# EasyEDA schematic Sheet_1.json
TITLE: ARDUINO PC JOYSTICK; REV: 1.0; Date: 2025-05-24; Sheet: 1/4; Drawn By: ILIAS ILIOPOULOS; Company: fryktoria.com
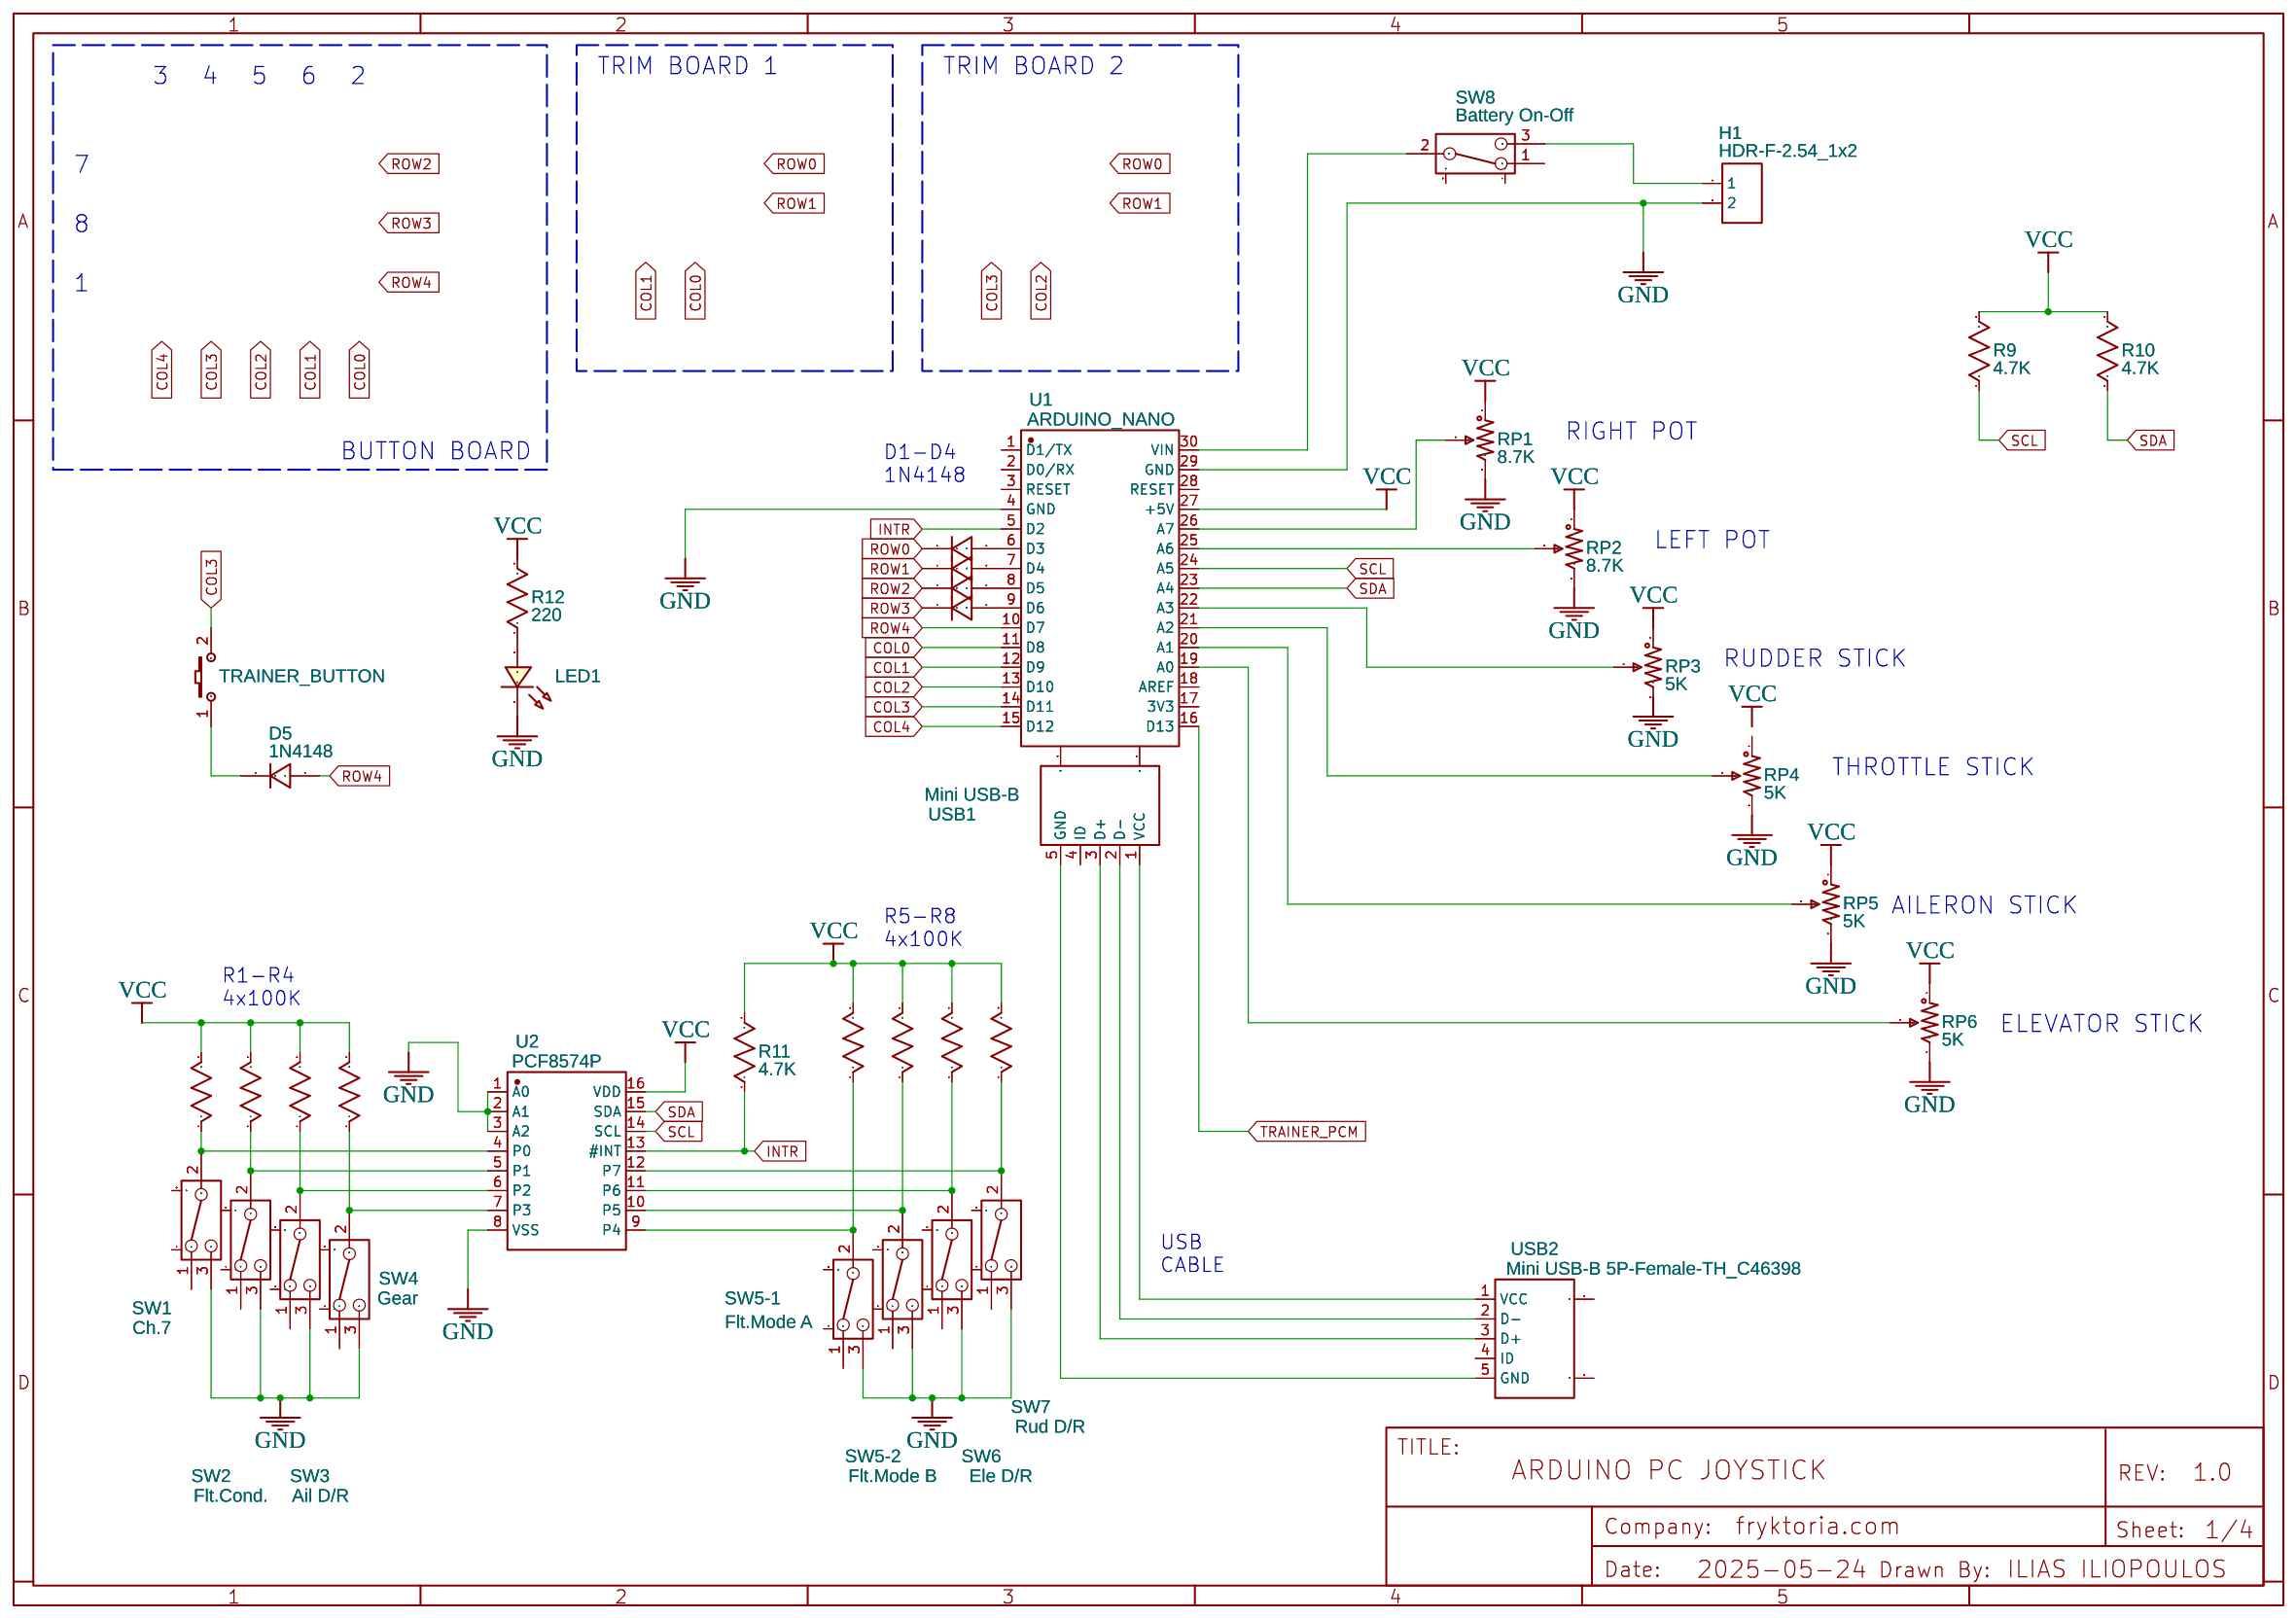
[diagram p0: schematic sheet]

## Parts
D1  1N4148  [DO-35_BD2.0-L4.2-P8.20-D0.5-RD]
D5  1N4148  [DO-35_BD2.0-L4.2-P8.20-D0.5-RD]
D5#2  1N4148  [DO-35_BD2.0-L4.2-P8.20-D0.5-RD]
D6  1N4148  [DO-35_BD2.0-L4.2-P8.20-D0.5-RD]
D7  1N4148  [DO-35_BD2.0-L4.2-P8.20-D0.5-RD]
H1  HDR-F-2.54_1x2  [HDR-F-2.54_1X2]
LED1  LED-0603_R  [LED0603_RED]
R5  8*100k  [R0603]
R6  1k  [R0603]
R7  1k  [R0603]
R8  1k  [R0603]
R9  4.7K  [R0603]
R10  1k  [R0603]
R10#2  4.7K  [R0603]
R11  1k  [R0603]
R11#2  4.7K  [R0603]
R12  1k  [R0603]
R12#2  220  [R0603]
R13  8*100k  [R0603]
RP1  8.7K  [RES-ADJ-TH_3386P]
RP2  8.7K  [RES-ADJ-TH_3386P]
RP3  5K  [RES-ADJ-TH_3386P]
RP4  5K  [RES-ADJ-TH_3386P]
RP5  5K  [RES-ADJ-TH_3386P]
RP6  5K  [RES-ADJ-TH_3386P]
SW1  Ch.7  [SW-TH_SK-12D02VG3]
SW2  Flt.Cond.  [SW-TH_SK-12D02VG3]
SW3  Ail D/R  [SW-TH_SK-12D02VG3]
SW4  Gear  [SW-TH_SK-12D02VG3]
SW5-1  Flt.Mode A  [SW-TH_SK-12D02VG3]
SW5-2  Flt.Mode B  [SW-TH_SK-12D02VG3]
SW6  Ele D/R  [SW-TH_SK-12D02VG3]
SW7  Rud D/R  [SW-TH_SK-12D02VG3]
SW8  Battery On-Off  [SW-TH_SK-12D02VG3]
TRAINER_BUTTON  K2-3.6×6.1_SMD  [KEY-SMD_2P-L6.2-W3.6-LS8.0]
U1  ARDUINO_NANO  [COMM-TH_ARDUINO_NANO]
U2  PCF8574P  [DIP-16_L19.3-W6.4-P2.54-LS7.6-BL]
USB1  Mini USB-B  [MINI-USB-TH_USB-MINI-2]
USB2  Mini USB-B 5P-Female-TH_C46398  [MINI-USB-TH_USB-MINI-2]

## Library data of the parts
D1 D5 D5#2 D6 D7 = 1N4148: Supplier: LCSC; Supplier Part: C13769; Manufacturer: STMicroelectronics; Contributor: LCSC
H1 = HDR-F-2.54_1x2: Supplier Part: C49661; Supplier: LCSC; Contributor: LCEDA_Lib
LED1 = LED-0603_R: Manufacturer: EVERLIGHT(台湾亿光); Manufacturer Part: 19-217/R6C-AL1M2VY/3T; Supplier Part: C72044; Supplier: LCSC; Contributor: LCEDA_01
R5-R10 R10#2 R11 R11#2 R12 R12#2 R13 = R_0603_US: Contributor: LCEDA_Lib
RP1-RP6 = R_3386P_US: Supplier: LCSC; Contributor: LCEDA_Lib; value(Ω): 10K
SW1-SW4 SW5-1 SW5-2 SW6-SW8 = SK-12D02-VG5: Supplier: LCSC; Supplier Part: C136722; Manufacturer: Rectangular Connectors - Contacts; Contributor: LCSC
TRAINER_BUTTON = K2-3.6×6.1_SMD: Supplier Part: C118141; Supplier: LCSC; Manufacturer Part: K2-1107ST-A4SW-06; Contributor: LCEDA_Lib; 制造商: 韩国韩荣
U1 = ARDUINO_NANO: Contributor: lcsc; Supplier: LCSC; Supplier Part: C9900017879; Manufacturer: null; JLCPCB Part Class: Extended Part
U2 = PCF8574P: Contributor: LCSC; Supplier: LCSC; Supplier Part: C398073; Manufacturer: HGSEMI(华冠); JLCPCB Part Class: Extended Part
USB1 USB2 = Mini USB-B 5P-Female-TH_C46398: Supplier: LCSC; Manufacturer: 精拓金; Manufacturer Part: 920-462A2021D10102; Supplier Part: C46398; JLCPCB Part Class: Extended Part

## Nets
GND: H1.2 LED1.2 RP1.3 RP2.3 RP4.3 RP5.3 RP6.3 SW1.3 SW2.3 SW3.3 SW4.3 SW5-1.3 SW5-2.3 SW6.3 SW7.3 U1.4(GND) U1.29(GND) U2.1(A0) U2.2(A1) U2.3(A2) U2.8(VSS)
VCC: R5.2 R6.2 R7.2 R8.2 R9.2 R10.2 R10#2.2 R11.2 R11#2.2 R12.2 R12#2.2 R13.2 RP1.1 RP2.1 RP3.1 RP5.1 RP6.1 U1.27(+5V) U2.16(VDD)
COL0: U1.11(D8)
COL1: U1.12(D9)
COL2: U1.13(D10)
COL3: TRAINER_BUTTON.2 U1.14(D11)
COL4: U1.15(D12)
INTR: R11#2.1 U1.5(D2) U2.13(#INT)
ROW0: D1.1
ROW1: D5.1
ROW2: D6.1
ROW3: D7.1
ROW4: D5#2.2 U1.10(D7)
SCL: R9.1 U1.24(A5) U2.14(SCL)
SDA: R10#2.1 U1.23(A4) U2.15(SDA)
TRAINER_PCM: U1.16(D13)
Net-(D1-2): D1.2 U1.6(D3)
Net-(D5#2-1): D5#2.1 TRAINER_BUTTON.1
Net-(D5-2): D5.2 U1.7(D4)
Net-(D6-2): D6.2 U1.8(D5)
Net-(D7-2): D7.2 U1.9(D6)
Net-(H1-1): H1.1 SW8.3
Net-(LED1-1): LED1.1 R12#2.1
Net-(R5-1): R5.1 SW4.2 U2.7(P3)
Net-(R6-1): R6.1 SW3.2 U2.6(P2)
Net-(R7-1): R7.1 SW2.2 U2.5(P1)
Net-(R8-1): R8.1 SW1.2 U2.4(P0)
Net-(R10-1): R10.1 SW5-1.2 U2.9(P4)
Net-(R11-1): R11.1 SW5-2.2 U2.10(P5)
Net-(R12-1): R12.1 SW6.2 U2.11(P6)
Net-(R13-1): R13.1 SW7.2 U2.12(P7)
Net-(RP1-2): RP1.2 U1.26(A7)
Net-(RP2-2): RP2.2 U1.25(A6)
Net-(RP3-2): RP3.2 U1.22(A3)
Net-(RP4-2): RP4.2 U1.21(A2)
Net-(RP5-2): RP5.2 U1.20(A1)
Net-(RP6-2): RP6.2 U1.19(A0)
Net-(SW8-2): SW8.2 U1.30(VIN)
Net-(USB1-1): USB1.1(VCC) USB2.1(VCC)
Net-(USB1-2): USB1.2(D-) USB2.2(D-)
Net-(USB1-3): USB1.3(D+) USB2.3(D+)
Net-(USB1-5): USB1.5(GND) USB2.5(GND)

Not connected (* = marked no-connect by the designer): RP3 3; RP4 1; SW1 1 4 5; SW2 1 4 5; SW3 1 4 5; SW4 1 4 5; SW5-1 1 4 5; SW5-2 1 4 5; SW6 1 4 5; SW7 1 4 5; SW8 1 4 5; U1 1(D1/TX) 2(D0/RX) 3(RESET) 17(3V3) 18(AREF) 28(RESET); USB1 0 4(ID); USB2 0 4(ID)

## Notes on the sheet
- 3
- 4
- 5
- 6
- 2
- TRIM BOARD 1
- TRIM BOARD 2
- 7
- 8
- 1
- RIGHT POT
- BUTTON BOARD
- D1-D4
  1N4148
- LEFT POT
- RUDDER STICK
- THROTTLE STICK
- R5-R8
  4x100K
- AILERON STICK
- R1-R4
  4x100K
- ELEVATOR STICK
- USB
  CABLE
